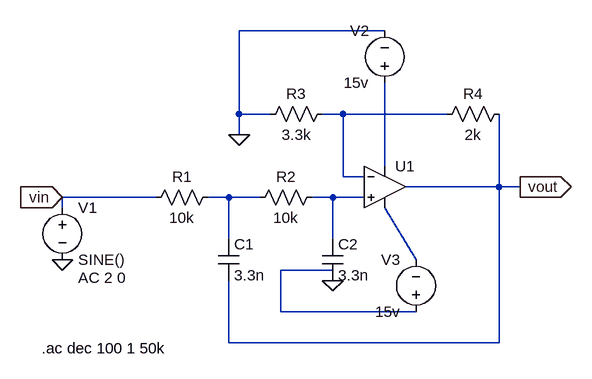
[diagram p0: schematic LP.asc]
LP.asc, the LTspice schematic file:
Version 4
SHEET 1 880 680
WIRE 352 -80 128 -80
WIRE 128 48 128 -80
WIRE 176 48 128 48
WIRE 288 48 256 48
WIRE 448 48 288 48
WIRE 128 80 128 48
WIRE 352 128 352 0
WIRE 288 144 288 48
WIRE 320 144 288 144
WIRE 528 160 528 48
WIRE 528 160 384 160
WIRE 560 160 528 160
WIRE 0 176 -144 176
WIRE 112 176 80 176
WIRE 160 176 112 176
WIRE 272 176 240 176
WIRE 320 176 272 176
WIRE -144 192 -144 176
WIRE 112 240 112 176
WIRE 272 240 272 176
WIRE 400 272 352 192
WIRE 272 288 192 288
WIRE 192 352 192 288
WIRE 400 352 192 352
WIRE 112 400 112 304
WIRE 528 400 528 160
WIRE 528 400 112 400
FLAG 128 80 0
FLAG 272 304 0
FLAG -144 272 0
FLAG 560 160 vout
IOPIN 560 160 Out
FLAG -144 176 vin
IOPIN -144 176 In
SYMBOL res -16 192 R270
WINDOW 0 32 56 VTop 2
WINDOW 3 0 56 VBottom 2
SYMATTR InstName R1
SYMATTR Value 10k
SYMBOL res 144 192 R270
WINDOW 0 32 56 VTop 2
WINDOW 3 0 56 VBottom 2
SYMATTR InstName R2
SYMATTR Value 10k
SYMBOL cap 96 240 R0
SYMATTR InstName C1
SYMATTR Value 3.3n
SYMBOL cap 256 240 R0
SYMATTR InstName C2
SYMATTR Value 3.3n
SYMBOL res 160 64 R270
WINDOW 0 32 56 VTop 2
WINDOW 3 0 56 VBottom 2
SYMATTR InstName R3
SYMATTR Value 3.3k
SYMBOL res 432 64 R270
WINDOW 0 32 56 VTop 2
WINDOW 3 0 56 VBottom 2
SYMATTR InstName R4
SYMATTR Value 2k
SYMBOL voltage -144 176 R0
WINDOW 123 24 124 Left 2
WINDOW 39 0 0 Left 2
SYMATTR Value2 AC 2 0
SYMATTR InstName V1
SYMATTR Value SINE()
SYMBOL voltage 352 16 R180
WINDOW 0 24 96 Left 2
WINDOW 3 24 16 Left 2
WINDOW 123 0 0 Left 2
WINDOW 39 0 0 Left 2
SYMATTR InstName V2
SYMATTR Value 15v
SYMBOL voltage 400 368 R180
WINDOW 0 24 96 Left 2
WINDOW 3 24 16 Left 2
WINDOW 123 0 0 Left 2
WINDOW 39 0 0 Left 2
SYMATTR InstName V3
SYMATTR Value 15v
SYMBOL OpAmps\\UniversalOpAmp 352 160 R0
SYMATTR InstName U1
TEXT -176 408 Left 2 !.ac dec 100 1 50k

The netlist it stands for:
* LP.asc
R1 vin N003 10k
R2 N003 N004 10k
C1 N003 vout 3.3n
C2 N004 0 3.3n
R3 0 N001 3.3k
R4 N001 vout 2k
V1 vin 0 SINE() AC 2 0
V2 N002 0 15v
V3 N006 N005 15v
XU1 N004 N001 N002 N005 vout level1 Avol=1Meg GBW=10Meg Vos=0 En=0 Enk=0 In=0 Ink=0 Rin=500Meg  ; pins In+ In- V+ V- OUT
.ac dec 100 1 50k
.lib UniversalOpAmp1.lib
.backanno
.end